# Altium schematic sheet EthernetSwitchBoard.SchDoc
size A
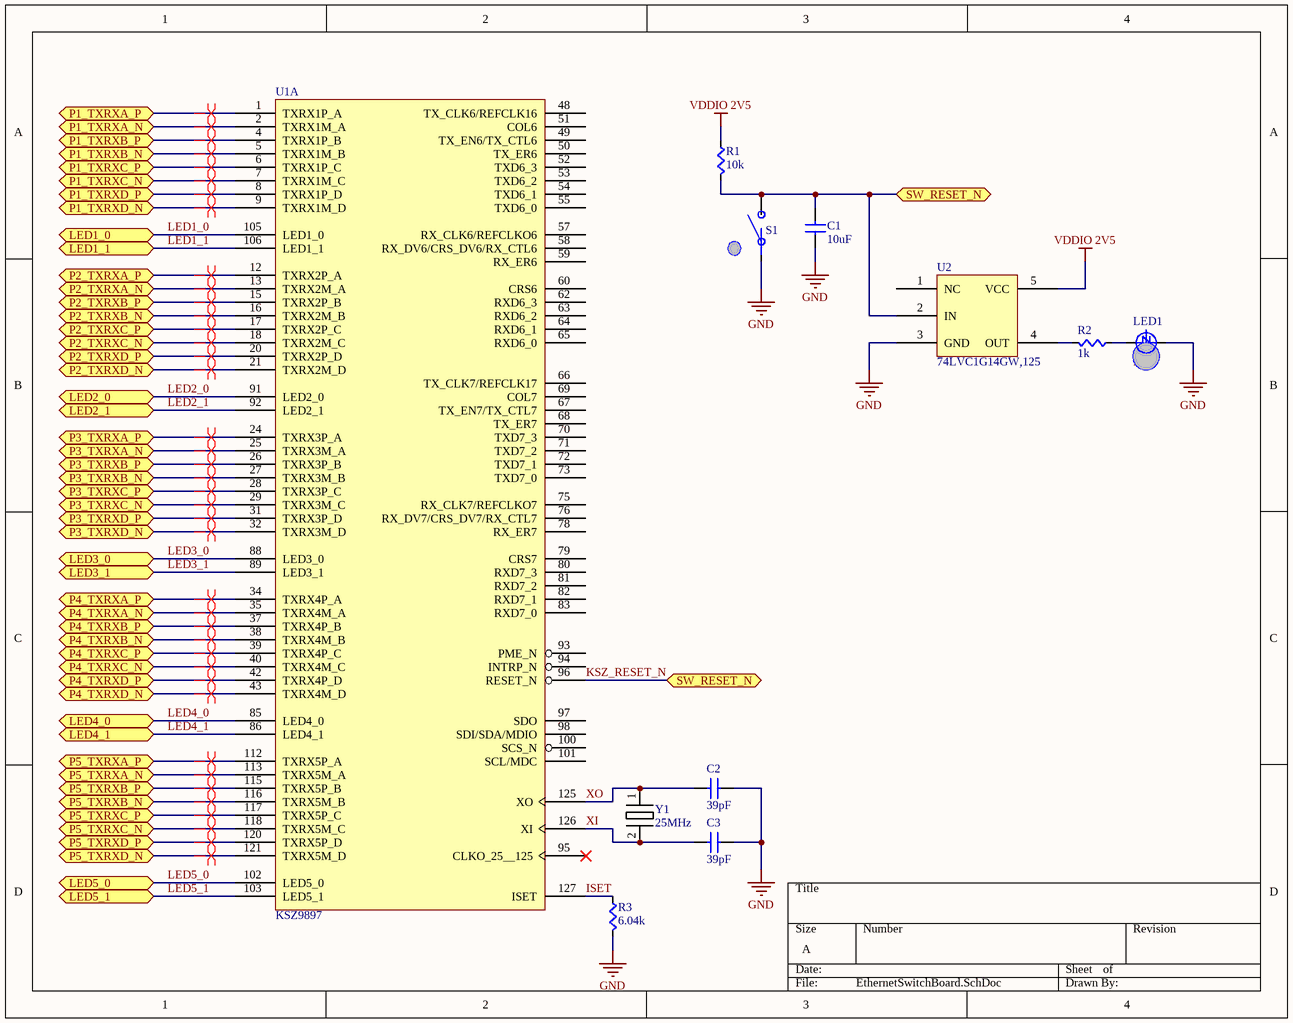
[diagram p0: EthernetSwitchBoard.SchDoc]

## Parts
C1  value 10uF  [CAPC0603]  (hidden comment: Cap)
C2  value 39pF  [CAPC0603]  (hidden comment: Cap)
C3  value 39pF  [CAPC0603]  (hidden comment: Cap)
LED1  Color: Red  [LED0603]  (hidden comment: LED)
R1  value 10k  [RES0603]  (hidden comment: Res)
R2  value 1k  [RES0603]  (hidden comment: Res)
R3  value 6.04k  [RES0603]  (hidden comment: Res)
S1  Button  [PTS645xxxxSMTR92]  (value not drawn)
U1  KSZ9897  [128-TQFP]  (part A of 2)
U2  74LVC1G14GW,125  [SOT35-5pin]
Y1  25MHz  [HC49/US]

## Ports
LED1_0 (bidir), LED1_1 (bidir), LED2_0 (bidir), LED2_1 (bidir), LED3_0 (bidir), LED3_1 (bidir), LED4_0 (bidir), LED4_1 (bidir), LED5_0 (bidir), LED5_1 (bidir), P1_TXRXA_N (bidir), P1_TXRXA_P (bidir), P1_TXRXB_N (bidir), P1_TXRXB_P (bidir), P1_TXRXC_N (bidir), P1_TXRXC_P (bidir), P1_TXRXD_N (bidir), P1_TXRXD_P (bidir), P2_TXRXA_N (bidir), P2_TXRXA_P (bidir), P2_TXRXB_N (bidir), P2_TXRXB_P (bidir), P2_TXRXC_N (bidir), P2_TXRXC_P (bidir), P2_TXRXD_N (bidir), P2_TXRXD_P (bidir), P3_TXRXA_N (bidir), P3_TXRXA_P (bidir), P3_TXRXB_N (bidir), P3_TXRXB_P (bidir), P3_TXRXC_N (bidir), P3_TXRXC_P (bidir), P3_TXRXD_N (bidir), P3_TXRXD_P (bidir), P4_TXRXA_N (bidir), P4_TXRXA_P (bidir), P4_TXRXB_N (bidir), P4_TXRXB_P (bidir), P4_TXRXC_N (bidir), P4_TXRXC_P (bidir), P4_TXRXD_N (bidir), P4_TXRXD_P (bidir), P5_TXRXA_N (bidir), P5_TXRXA_P (bidir), P5_TXRXB_N (bidir), P5_TXRXB_P (bidir), P5_TXRXC_N (bidir), P5_TXRXC_P (bidir), P5_TXRXD_N (bidir), P5_TXRXD_P (bidir), SW_RESET_N (bidir)

## Nets
GND: C1.2(B) C2.2(B) C3.2(B) LED1.C R3.1(A) S1.A U2.3(GND)
VDDIO 2V5: R1.2(B) U2.5(VCC)
ISET: R3.2(B) U1.127(ISET)
KSZ_RESET_N: C1.1(A) R1.1(A) S1.B U1.96(RESET_N) U2.2(IN) ; port SW_RESET_N
LED1_0: U1.105(LED1_0) ; port LED1_0
LED1_1: U1.106(LED1_1) ; port LED1_1
LED2_0: U1.91(LED2_0) ; port LED2_0
LED2_1: U1.92(LED2_1) ; port LED2_1
LED3_0: U1.88(LED3_0) ; port LED3_0
LED3_1: U1.89(LED3_1) ; port LED3_1
LED4_0: U1.85(LED4_0) ; port LED4_0
LED4_1: U1.86(LED4_1) ; port LED4_1
LED5_0: U1.102(LED5_0) ; port LED5_0
LED5_1: U1.103(LED5_1) ; port LED5_1
P1_TXRXA_N: U1.2(TXRX1M_A) ; port P1_TXRXA_N
P1_TXRXA_P: U1.1(TXRX1P_A) ; port P1_TXRXA_P
P1_TXRXB_N: U1.5(TXRX1M_B) ; port P1_TXRXB_N
P1_TXRXB_P: U1.4(TXRX1P_B) ; port P1_TXRXB_P
P1_TXRXC_N: U1.7(TXRX1M_C) ; port P1_TXRXC_N
P1_TXRXC_P: U1.6(TXRX1P_C) ; port P1_TXRXC_P
P1_TXRXD_N: U1.9(TXRX1M_D) ; port P1_TXRXD_N
P1_TXRXD_P: U1.8(TXRX1P_D) ; port P1_TXRXD_P
P2_TXRXA_N: U1.13(TXRX2M_A) ; port P2_TXRXA_N
P2_TXRXA_P: U1.12(TXRX2P_A) ; port P2_TXRXA_P
P2_TXRXB_N: U1.16(TXRX2M_B) ; port P2_TXRXB_N
P2_TXRXB_P: U1.15(TXRX2P_B) ; port P2_TXRXB_P
P2_TXRXC_N: U1.18(TXRX2M_C) ; port P2_TXRXC_N
P2_TXRXC_P: U1.17(TXRX2P_C) ; port P2_TXRXC_P
P2_TXRXD_N: U1.21(TXRX2M_D) ; port P2_TXRXD_N
P2_TXRXD_P: U1.20(TXRX2P_D) ; port P2_TXRXD_P
P3_TXRXA_N: U1.25(TXRX3M_A) ; port P3_TXRXA_N
P3_TXRXA_P: U1.24(TXRX3P_A) ; port P3_TXRXA_P
P3_TXRXB_N: U1.27(TXRX3M_B) ; port P3_TXRXB_N
P3_TXRXB_P: U1.26(TXRX3P_B) ; port P3_TXRXB_P
P3_TXRXC_N: U1.29(TXRX3M_C) ; port P3_TXRXC_N
P3_TXRXC_P: U1.28(TXRX3P_C) ; port P3_TXRXC_P
P3_TXRXD_N: U1.32(TXRX3M_D) ; port P3_TXRXD_N
P3_TXRXD_P: U1.31(TXRX3P_D) ; port P3_TXRXD_P
P4_TXRXA_N: U1.35(TXRX4M_A) ; port P4_TXRXA_N
P4_TXRXA_P: U1.34(TXRX4P_A) ; port P4_TXRXA_P
P4_TXRXB_N: U1.38(TXRX4M_B) ; port P4_TXRXB_N
P4_TXRXB_P: U1.37(TXRX4P_B) ; port P4_TXRXB_P
P4_TXRXC_N: U1.40(TXRX4M_C) ; port P4_TXRXC_N
P4_TXRXC_P: U1.39(TXRX4P_C) ; port P4_TXRXC_P
P4_TXRXD_N: U1.43(TXRX4M_D) ; port P4_TXRXD_N
P4_TXRXD_P: U1.42(TXRX4P_D) ; port P4_TXRXD_P
P5_TXRXA_N: U1.113(TXRX5M_A) ; port P5_TXRXA_N
P5_TXRXA_P: U1.112(TXRX5P_A) ; port P5_TXRXA_P
P5_TXRXB_N: U1.116(TXRX5M_B) ; port P5_TXRXB_N
P5_TXRXB_P: U1.115(TXRX5P_B) ; port P5_TXRXB_P
P5_TXRXC_N: U1.118(TXRX5M_C) ; port P5_TXRXC_N
P5_TXRXC_P: U1.117(TXRX5P_C) ; port P5_TXRXC_P
P5_TXRXD_N: U1.121(TXRX5M_D) ; port P5_TXRXD_N
P5_TXRXD_P: U1.120(TXRX5P_D) ; port P5_TXRXD_P
XI: C3.1(A) U1.126(XI) Y1.2
XO: C2.1(A) U1.125(XO) Y1.1
NetLED1_A: LED1.A R2.2(B)
NetR2_1: R2.1(A) U2.4(OUT)

Not connected (* = marked no-connect by the designer): U1 48(TX_CLK6/REFCLK16) 49(TX_EN6/TX_CTL6) 50(TX_ER6) 51(COL6) 52(TXD6_3) 53(TXD6_2) 54(TXD6_1) 55(TXD6_0) 57(RX_CLK6/REFCLKO6) 58(RX_DV6/CRS_DV6/RX_CTL6) 59(RX_ER6) 60(CRS6) 62(RXD6_3) 63(RXD6_2) 64(RXD6_1) 65(RXD6_0) 66(TX_CLK7/REFCLK17) 67(TX_EN7/TX_CTL7) 68(TX_ER7) 69(COL7) 70(TXD7_3) 71(TXD7_2) 72(TXD7_1) 73(TXD7_0) 75(RX_CLK7/REFCLKO7) 76(RX_DV7/CRS_DV7/RX_CTL7) 78(RX_ER7) 79(CRS7) 80(RXD7_3) 81(RXD7_2) 82(RXD7_1) 83(RXD7_0) 93(PME_N) 94(INTRP_N) 95(CLKO_25__125)* 97(SDO) 98(SDI/SDA/MDIO) 100(SCS_N) 101(SCL/MDC); U2 1(NC)

## Layout directives
differential pair: P1_TXRXA_N, P1_TXRXA_P, P1_TXRXB_N, P1_TXRXB_P, P1_TXRXC_N, P1_TXRXC_P, P1_TXRXD_N, P1_TXRXD_P, P2_TXRXA_N, P2_TXRXA_P, P2_TXRXB_N, P2_TXRXB_P, P2_TXRXC_N, P2_TXRXC_P, P2_TXRXD_N, P2_TXRXD_P, P3_TXRXA_N, P3_TXRXA_P, P3_TXRXB_N, P3_TXRXB_P, P3_TXRXC_N, P3_TXRXC_P, P3_TXRXD_N, P3_TXRXD_P, P4_TXRXA_N, P4_TXRXA_P, P4_TXRXB_N, P4_TXRXB_P, P4_TXRXC_N, P4_TXRXC_P, P4_TXRXD_N, P4_TXRXD_P, P5_TXRXA_N, P5_TXRXA_P, P5_TXRXB_N, P5_TXRXB_P, P5_TXRXC_N, P5_TXRXC_P, P5_TXRXD_N, P5_TXRXD_P

## Library data of the parts
C2 C3 = Cap: CAP CER 39PF 100V C0G/NP0 0603; Supplier 1: Digi-Key; Supplier Part Number 1: 478-5773-1-ND
S1 = Button: SPST Button; Supplier 1: Digi-Key; Supplier Part Number 1: CKN9087CT-ND
U1 = KSZ9897RTXC-TR: Ethernet Switch 10/100/1000 Base-T PHY I²C, SPI Interface 128-TQFP (14x14); Supplier 1: Digi-Key; Supplier Part Number 1: KSZ9897RTXC-CT-ND
U2 = 74LVC1G14GW,125: IC SCHMITT-TRIG INV 5TSSOP; Supplier Part Number 1: 1727-3072-1-ND; Supplier 1: Digi-Key
Y1 = ABLS-25.000MHZ-B4-F-T: 25MHz ±30ppm Crystal 18pF 40 Ohm -20°C ~ 70°C Surface Mount HC49/US; Supplier Part Number 1: 535-10235-1-ND; Supplier 1: Digi-Key
C1 = Cap: Supplier 1: Digi-Key; Supplier Part Number 1: 1276-1119-1-ND
LED1 = LED: Supplier 1: Digi-Key; Supplier Part Number 1: 754-1122-1-ND
R1-R3 = Res: Supplier 1: Digi-Key
  R1: Supplier Part Number 1: RMCF0603JT10K0CT-ND
  R2: Supplier Part Number 1: RMCF0603JT1K00CT-ND
  R3: Supplier Part Number 1: RMCF0603FT6K04CT-ND